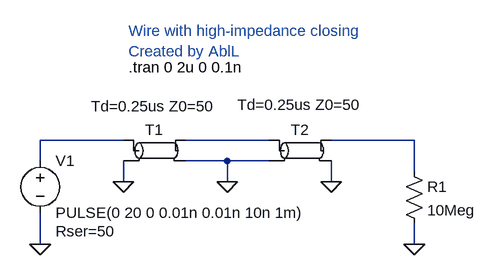
[diagram p0: schematic Leitungstheorie-Leerlauf.asc]
Leitungstheorie-Leerlauf.asc, the LTspice schematic file:
Version 4
SHEET 1 880 680
WIRE -208 96 -336 96
WIRE 16 96 -112 96
WIRE 240 96 112 96
WIRE -336 128 -336 96
WIRE -48 128 -112 128
WIRE 16 128 -48 128
WIRE 240 144 240 96
WIRE -208 160 -208 128
WIRE -48 160 -48 128
WIRE 112 160 112 128
WIRE -336 256 -336 208
WIRE 240 256 240 224
FLAG -336 256 0
FLAG -208 160 0
FLAG -48 160 0
FLAG 112 160 0
FLAG 240 256 0
SYMBOL voltage -336 112 R0
WINDOW 123 0 0 Left 0
WINDOW 39 24 124 Left 2
SYMATTR SpiceLine Rser=50
SYMATTR InstName V1
SYMATTR Value PULSE(0 20 0 0.01n 0.01n 10n 1m)
SYMBOL tline -160 112 R0
WINDOW 3 -2 -84 Top 2
SYMATTR Value Td=0.25us Z0=50
SYMATTR InstName T1
SYMBOL tline 64 112 R0
WINDOW 3 0 -86 Top 2
SYMATTR Value Td=0.25us Z0=50
SYMATTR InstName T2
SYMBOL res 224 128 R0
SYMATTR InstName R1
SYMATTR Value 10Meg
TEXT -200 -16 Left 2 !.tran 0 2u 0 0.1n
TEXT -200 -72 Left 2 ;Wire with high-impedance closing\nCreated by AblL

The netlist it stands for:
* Leitungstheorie-Leerlauf.asc
V1 N001 0 PULSE(0 20 0 0.01n 0.01n 10n 1m) Rser=50
T1 N001 0 N002 0 Td=0.25us Z0=50
T2 N002 0 N003 0 Td=0.25us Z0=50
R1 N003 0 10Meg
.tran 0 2u 0 0.1n
* Wire with high-impedance closing
* Created by AblL
.backanno
.end